# EAGLE design reference-tee-16pin (EAGLE 7.7.0)
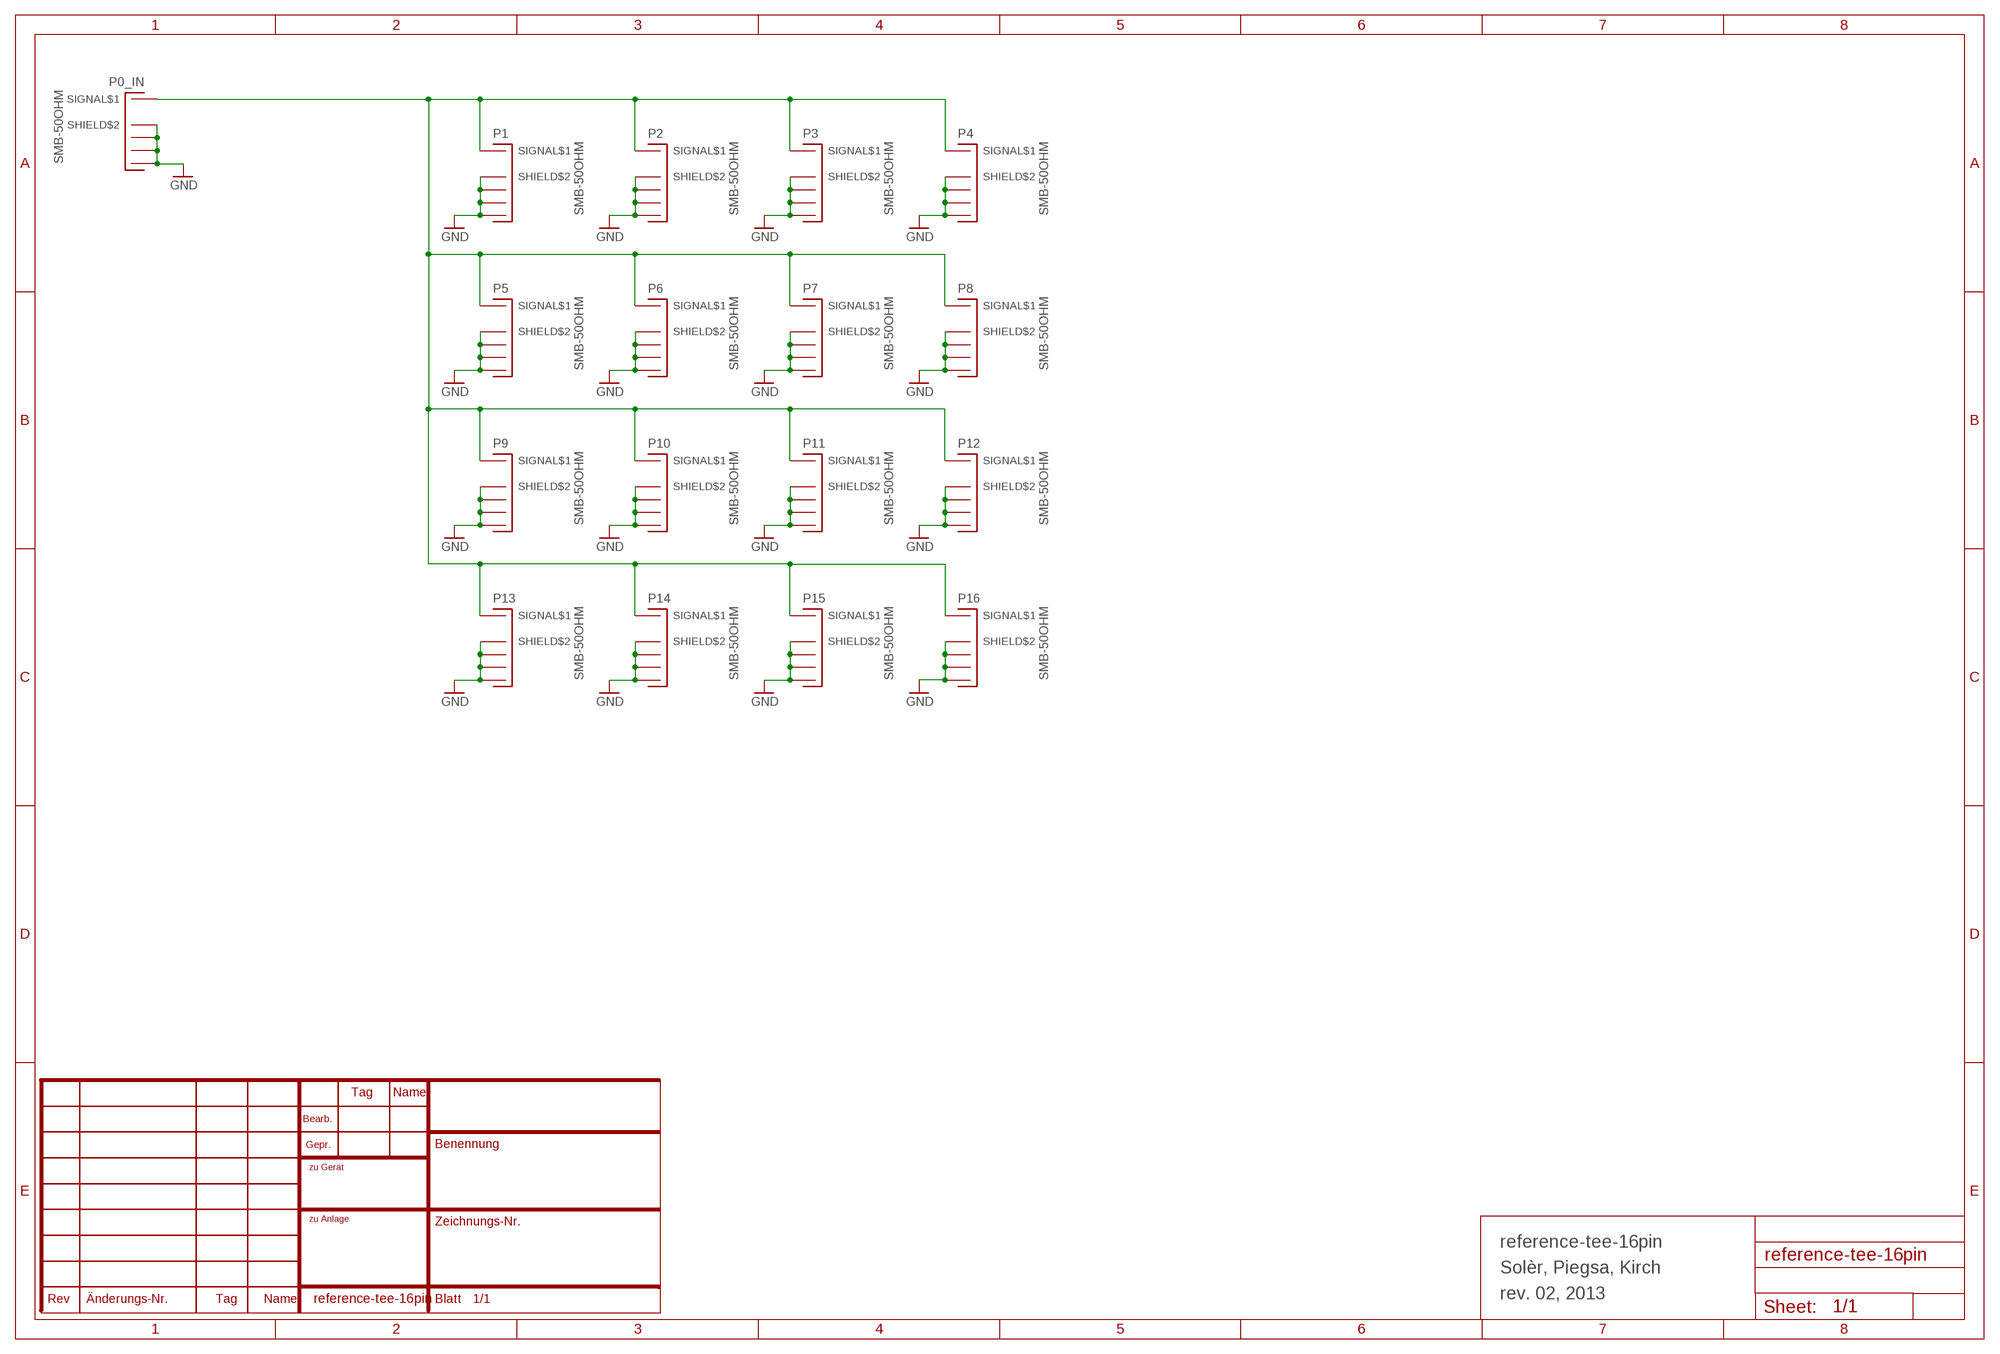
[diagram p0: schematic, sheet 1]

## Parts
P0_IN  SMB-50OHM  [B-30]
P1  SMB-50OHM  [B-30]
P2  SMB-50OHM  [B-30]
P3  SMB-50OHM  [B-30]
P4  SMB-50OHM  [B-30]
P5  SMB-50OHM  [B-30]
P6  SMB-50OHM  [B-30]
P7  SMB-50OHM  [B-30]
P8  SMB-50OHM  [B-30]
P9  SMB-50OHM  [B-30]
P10  SMB-50OHM  [B-30]
P11  SMB-50OHM  [B-30]
P12  SMB-50OHM  [B-30]
P13  SMB-50OHM  [B-30]
P14  SMB-50OHM  [B-30]
P15  SMB-50OHM  [B-30]
P16  SMB-50OHM  [B-30]

## Nets
GND: P0_IN.P$2(SHIELD$2) P0_IN.P$3(SHIELD$3) P0_IN.P$4(SHIELD$4) P0_IN.P$5(SHIELD$5) P1.P$2(SHIELD$2) P1.P$3(SHIELD$3) P1.P$4(SHIELD$4) P1.P$5(SHIELD$5) P2.P$2(SHIELD$2) P2.P$3(SHIELD$3) P2.P$4(SHIELD$4) P2.P$5(SHIELD$5) P3.P$2(SHIELD$2) P3.P$3(SHIELD$3) P3.P$4(SHIELD$4) P3.P$5(SHIELD$5) P4.P$2(SHIELD$2) P4.P$3(SHIELD$3) P4.P$4(SHIELD$4) P4.P$5(SHIELD$5) P5.P$2(SHIELD$2) P5.P$3(SHIELD$3) P5.P$4(SHIELD$4) P5.P$5(SHIELD$5) P6.P$2(SHIELD$2) P6.P$3(SHIELD$3) P6.P$4(SHIELD$4) P6.P$5(SHIELD$5) P7.P$2(SHIELD$2) P7.P$3(SHIELD$3) P7.P$4(SHIELD$4) P7.P$5(SHIELD$5) P8.P$2(SHIELD$2) P8.P$3(SHIELD$3) P8.P$4(SHIELD$4) P8.P$5(SHIELD$5) P9.P$2(SHIELD$2) P9.P$3(SHIELD$3) P9.P$4(SHIELD$4) P9.P$5(SHIELD$5) P10.P$2(SHIELD$2) P10.P$3(SHIELD$3) P10.P$4(SHIELD$4) P10.P$5(SHIELD$5) P11.P$2(SHIELD$2) P11.P$3(SHIELD$3) P11.P$4(SHIELD$4) P11.P$5(SHIELD$5) P12.P$2(SHIELD$2) P12.P$3(SHIELD$3) P12.P$4(SHIELD$4) P12.P$5(SHIELD$5) P13.P$2(SHIELD$2) P13.P$3(SHIELD$3) P13.P$4(SHIELD$4) P13.P$5(SHIELD$5) P14.P$2(SHIELD$2) P14.P$3(SHIELD$3) P14.P$4(SHIELD$4) P14.P$5(SHIELD$5) P15.P$2(SHIELD$2) P15.P$3(SHIELD$3) P15.P$4(SHIELD$4) P15.P$5(SHIELD$5) P16.P$2(SHIELD$2) P16.P$3(SHIELD$3) P16.P$4(SHIELD$4) P16.P$5(SHIELD$5)
N$1: P0_IN.P$1(SIGNAL$1) P1.P$1(SIGNAL$1) P2.P$1(SIGNAL$1) P3.P$1(SIGNAL$1) P4.P$1(SIGNAL$1) P5.P$1(SIGNAL$1) P6.P$1(SIGNAL$1) P7.P$1(SIGNAL$1) P8.P$1(SIGNAL$1) P9.P$1(SIGNAL$1) P10.P$1(SIGNAL$1) P11.P$1(SIGNAL$1) P12.P$1(SIGNAL$1) P13.P$1(SIGNAL$1) P14.P$1(SIGNAL$1) P15.P$1(SIGNAL$1) P16.P$1(SIGNAL$1)

## Notes on the sheet
- reference-tee-16pin
- Solèr, Piegsa, Kirch
- rev. 02, 2013

## Library data of the parts
P0_IN P1-P16 = parts:SMB-50OHM

## Board
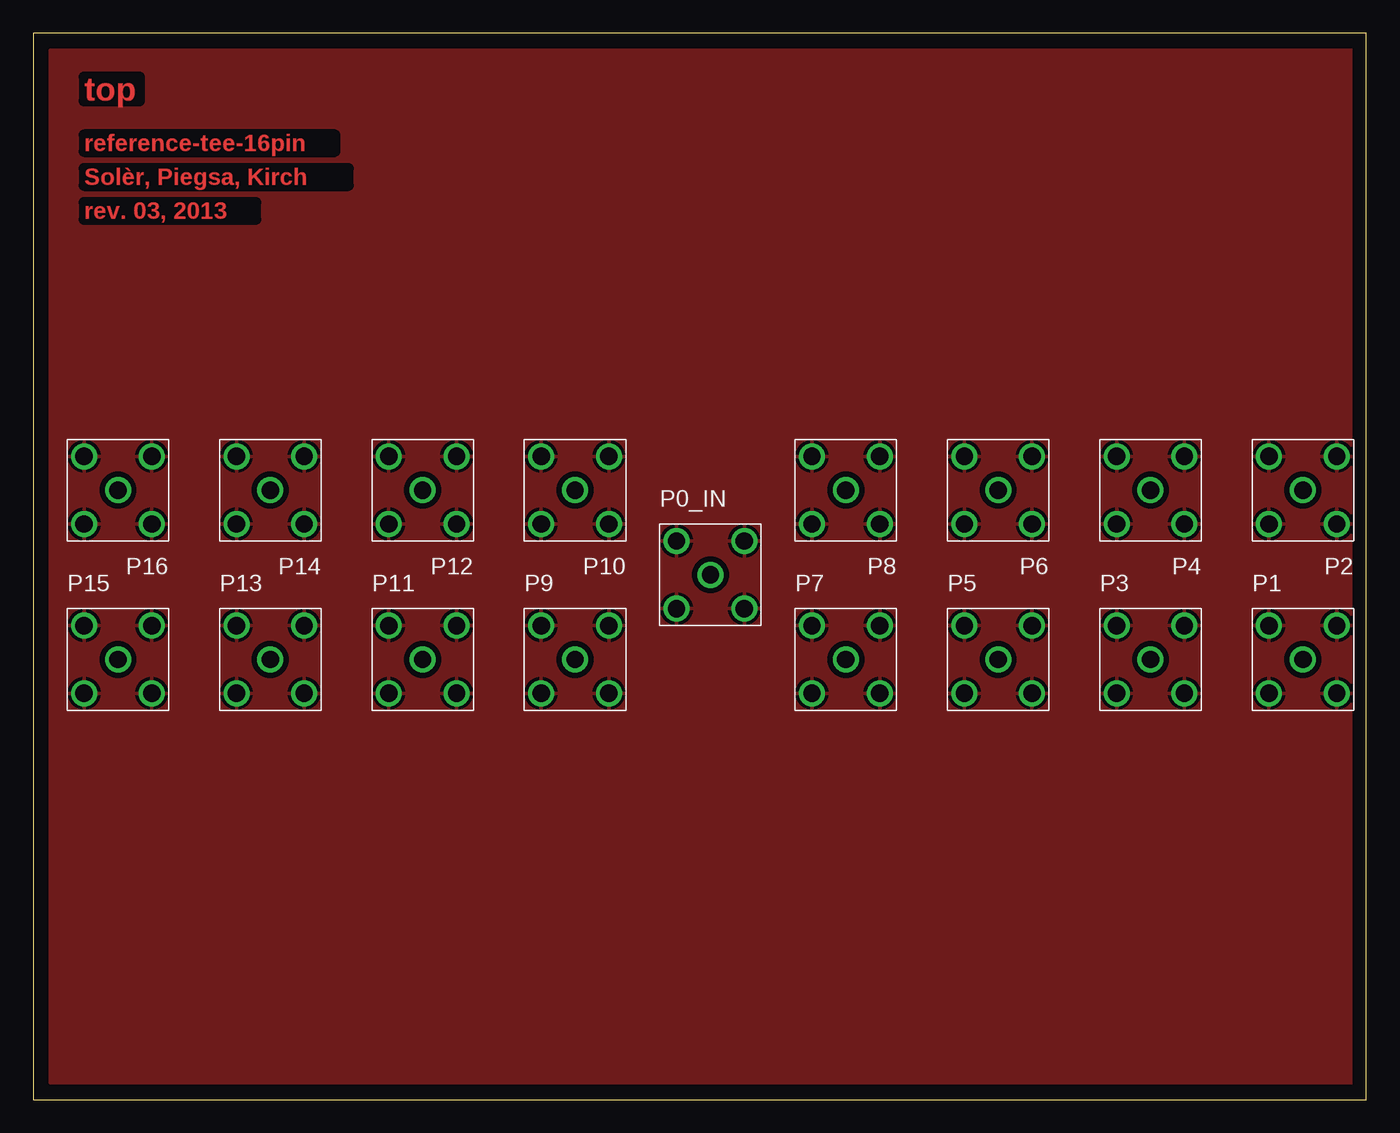
[diagram p1: board, top side]
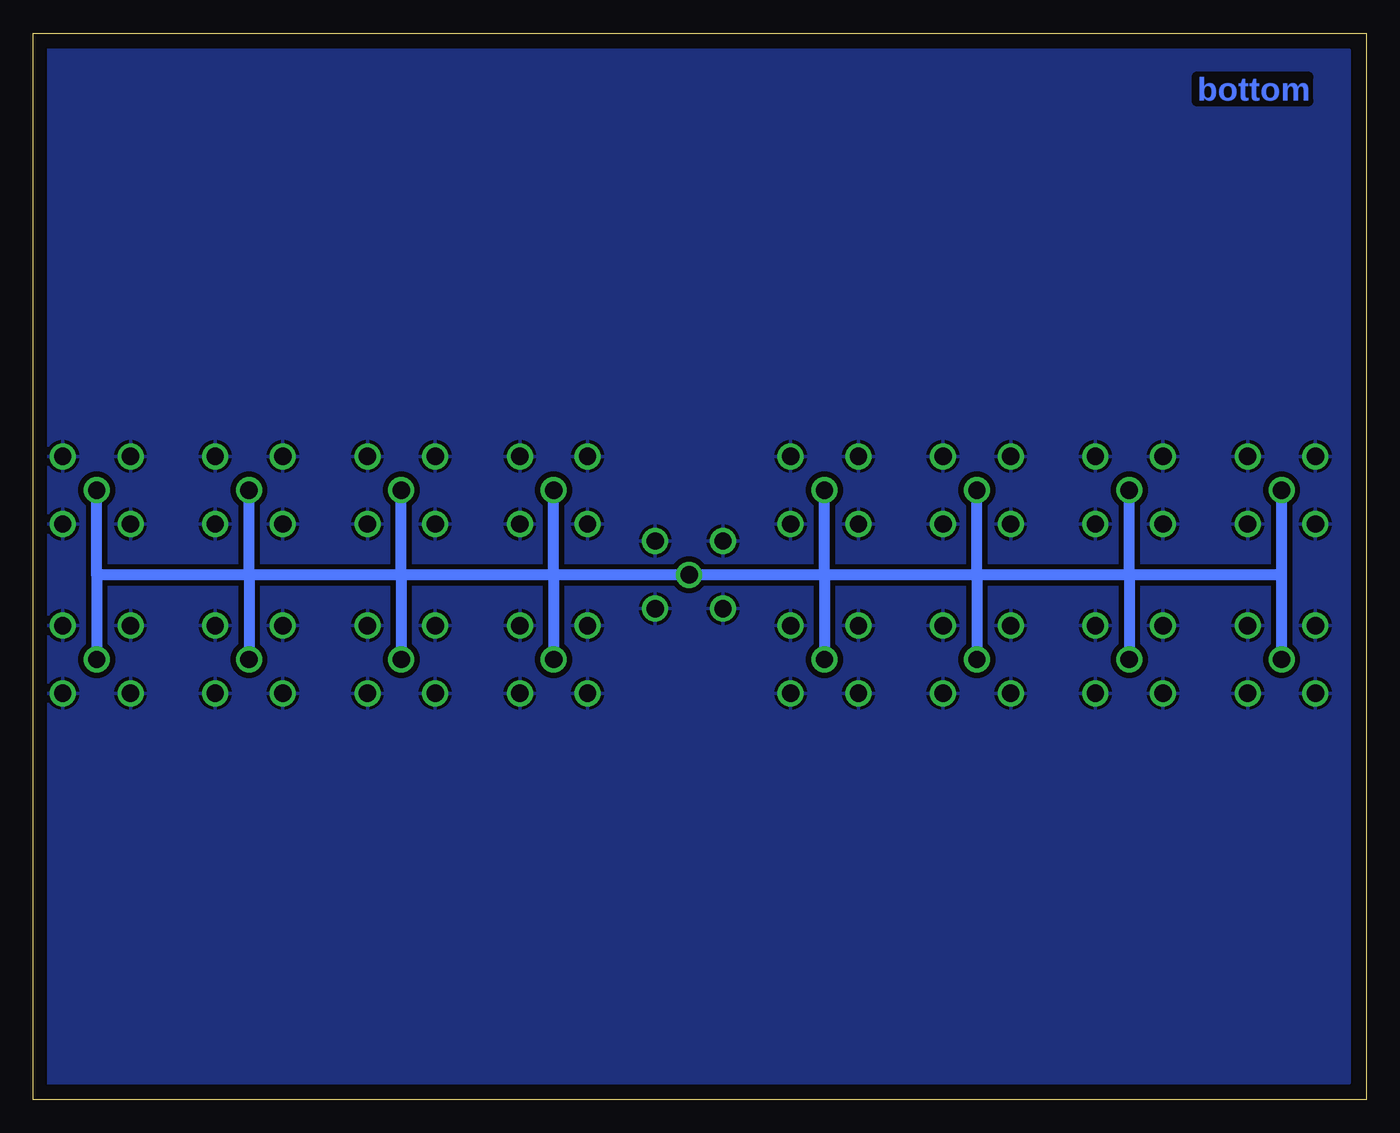
[diagram p2: board, bottom side, seen from below]

Size 100 x 80 mm. Coordinates in mm from the lower left corner, seen from the top.
Outline: 0,0 100,0 100,80 0,80 0,0
Copper layers (1*16): Top 0.035mm / dielectric 1.5mm / Bottom 0.035mm
Design rules "default": minimum track width 10mil, minimum drill 24mil, track to track 8mil, track to pad 8mil, pad to pad 8mil, via to via 8mil, smd to smd 8mil, copper to edge 40mil, drill to drill 8mil, minimum pad ring 10mil, minimum via ring 8mil, stop-mask expansion 4mil, vias tented up to drill 0mil, thermal gap 10mil

### Footprints (pad centres in the part's own frame; a part is rotated, then mirrored left to right if it is on the bottom)
B-30 = drill 1.3: P$1 0,0; P$2 -2.54,2.54; P$3 -2.54,-2.54; P$4 2.54,-2.54; P$5 2.54,2.54

### Placement (x,y rotation side)
P0_IN  50.8,39.37 0 top
P1  95.25,33.02 0 top
P2  95.25,45.72 180 top
P3  83.82,33.02 0 top
P4  83.82,45.72 180 top
P5  72.39,33.02 0 top
P6  72.39,45.72 180 top
P7  60.96,33.02 0 top
P8  60.96,45.72 180 top
P9  40.64,33.02 0 top
P10  40.64,45.72 180 top
P11  29.21,33.02 0 top
P12  29.21,45.72 180 top
P13  17.78,33.02 0 top
P14  17.78,45.72 180 top
P15  6.35,33.02 0 top
P16  6.35,45.72 180 top

### Tracks (layer width: path | path; a pad name or v marks a point on that pad's centre or on a via)
GND
  pour Bottom (isolate 0.406): 1.27,78.74 99.06,78.74 99.06,1.27 1.27,1.27
  pour Top (isolate 0.406): 1.27,78.74 99.06,78.74 99.06,1.27 1.27,1.27
N$1
  Bottom 0.813: 60.96,39.37 P0_IN.P$1 40.64,39.37 | 60.96,39.37 P8.P$1 | 60.96,39.37 P7.P$1 | 72.39,39.37 P6.P$1 | 60.96,39.37 72.39,39.37 | 83.82,39.37 P4.P$1 | 72.39,39.37 83.82,39.37 | 95.25,39.37 P2.P$1 | 83.82,39.37 95.25,39.37 | 72.39,39.37 P5.P$1 | 83.82,39.37 P3.P$1 | 95.25,39.37 P1.P$1 | 40.64,39.37 P10.P$1 | 40.64,39.37 P9.P$1 | 29.21,39.37 P12.P$1 | 29.21,39.37 40.64,39.37 | 29.21,39.37 P11.P$1 | 17.78,39.37 P14.P$1 | 17.78,39.37 29.21,39.37 | 6.35,39.37 P16.P$1 | 6.35,39.37 17.78,39.37 | 17.78,39.37 P13.P$1 | P15.P$1 6.35,39.37

### Text on the board
Top: top | reference-tee-16pin | Solèr, Piegsa, Kirch | rev. 03, 2013
Bottom: bottom